# EAGLE design D32 Pro Benchtop Test Board (EAGLE 9.6.2)
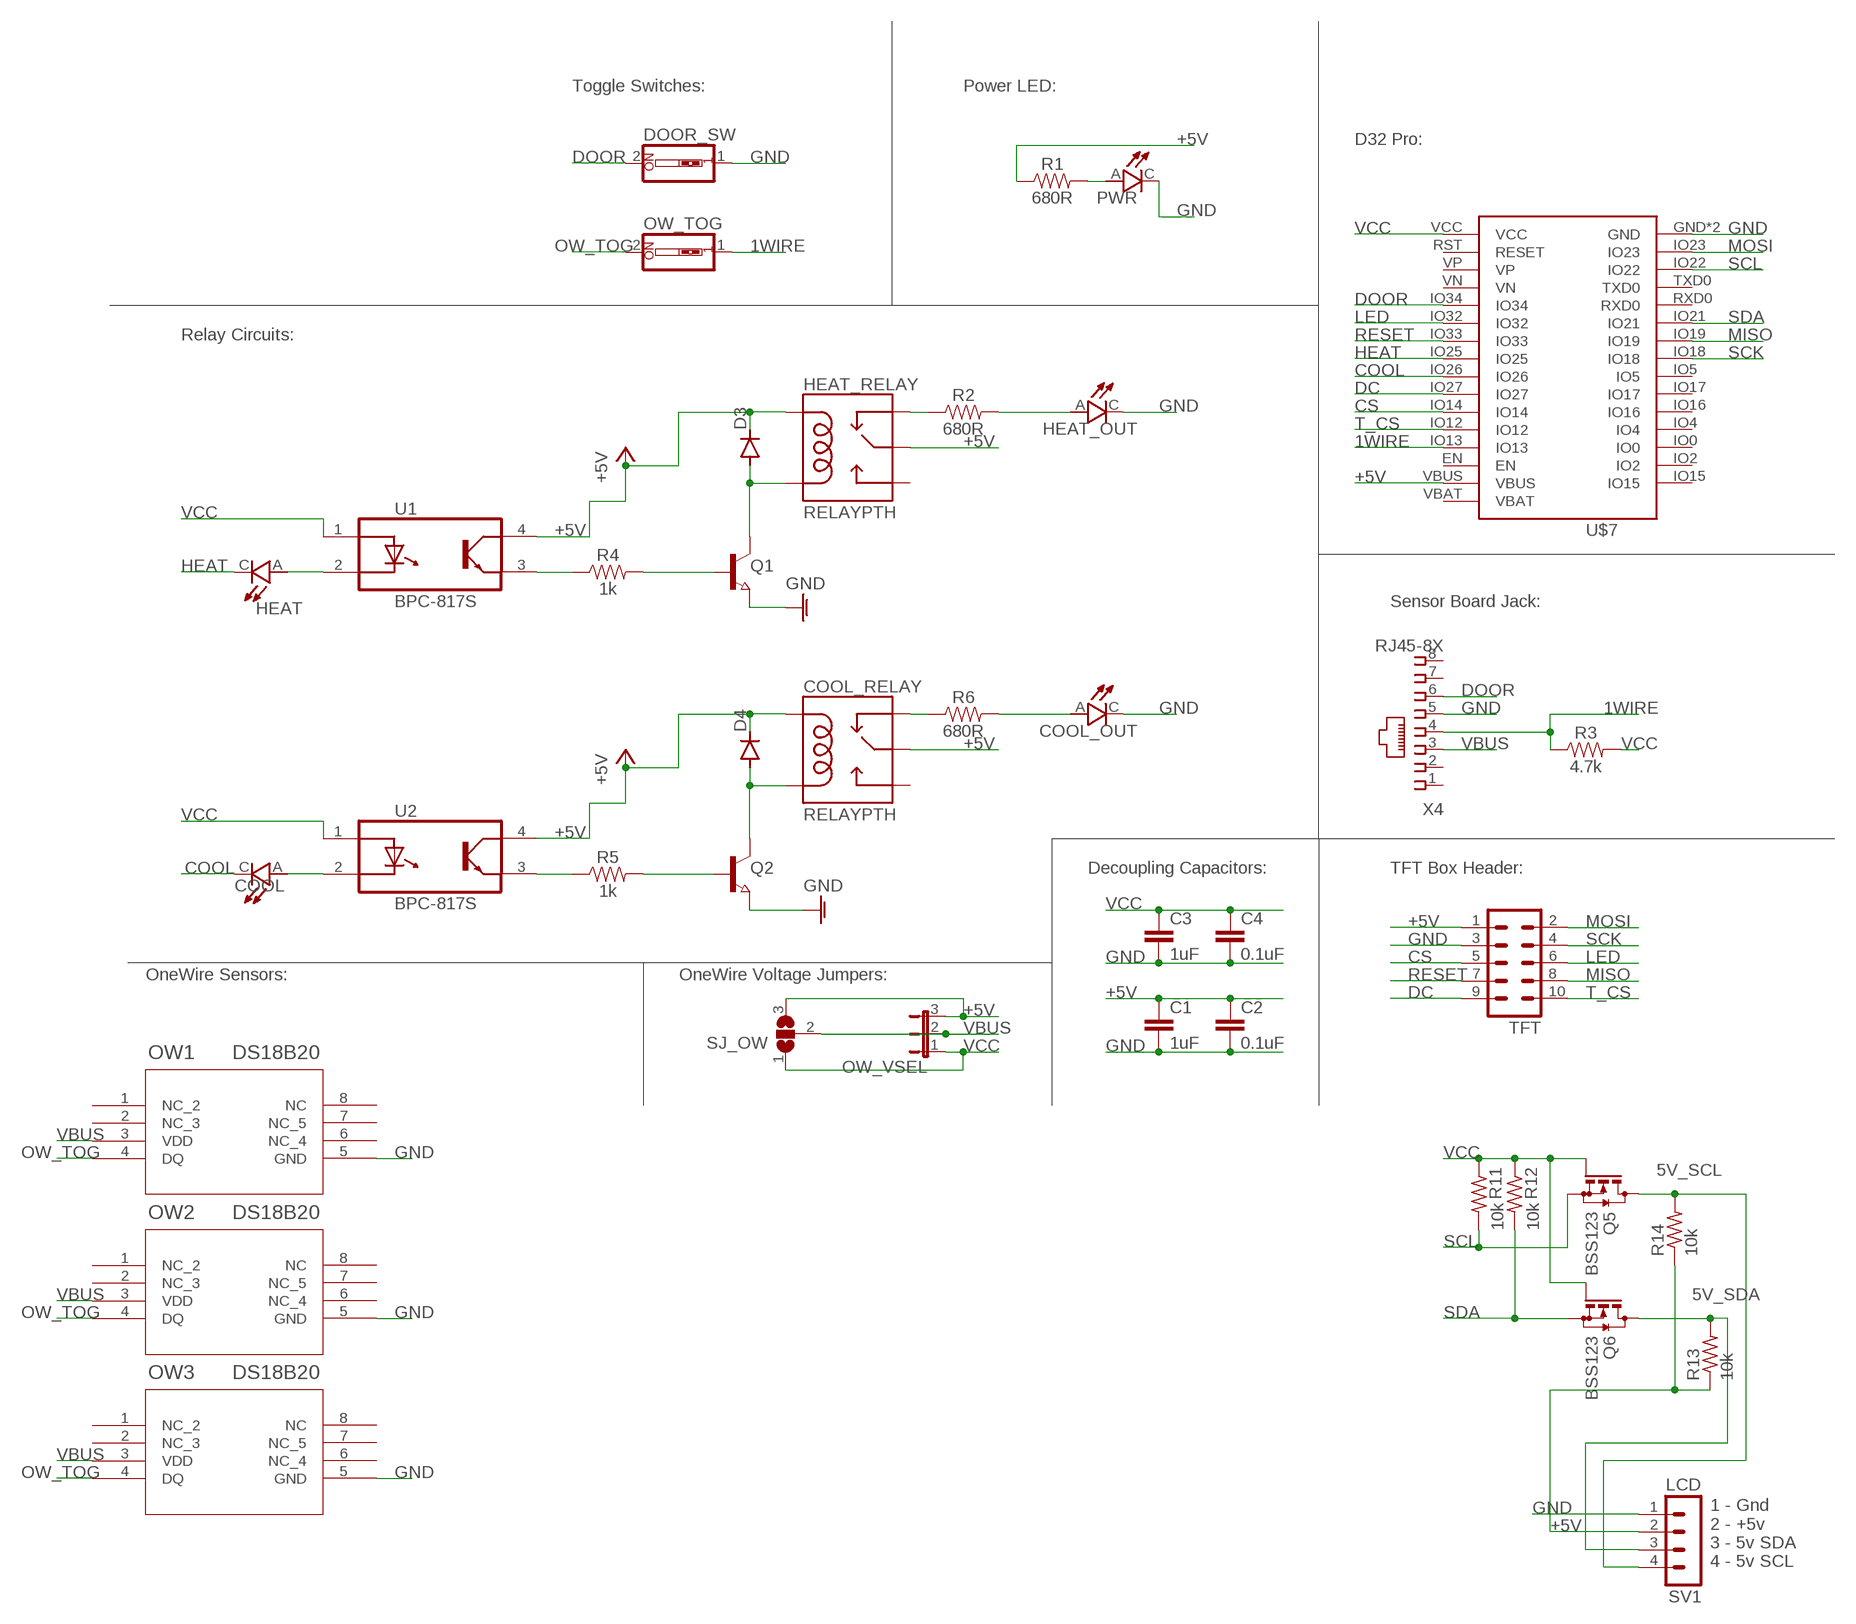
[diagram p0: schematic, sheet 1]

## Parts
C1  1uF  CAP_SMD0805  [SMD-0805]
C2  0.1uF  CAP_SMD0805  [SMD-0805]
C3  1uF  CAP_SMD0805  [SMD-0805]
C4  0.1uF  CAP_SMD0805  [SMD-0805]
COOL  LED_0603LED_SMD_0603  [LED_SMD_0603]
COOL_OUT  LED_0603LED_SMD_0603  [LED_SMD_0603]
COOL_RELAY  RELAYPTH  [SRD-05VDC-SL-C]
D3  DIODE-DO214AC  [DO214AC]
D4  DIODE-DO214AC  [DO214AC]
DOOR_SW  SW_DIP-1  [EDG-01]
HEAT  LED_0603LED_SMD_0603  [LED_SMD_0603]
HEAT_OUT  LED_0603LED_SMD_0603  [LED_SMD_0603]
HEAT_RELAY  RELAYPTH  [SRD-05VDC-SL-C]
OW1  DS18B20  DS18B20Z+T&R  [21-0041B_8_MXM]
OW2  DS18B20  DS18B20Z+T&R  [21-0041B_8_MXM]
OW3  DS18B20  DS18B20Z+T&R  [21-0041B_8_MXM]
OW_TOG  SW_DIP-1  [EDG-01]
OW_VSEL  JP2ENOLABEL  [JP2-NOLABEL]
PWR  LED_0603LED_SMD_0603  [LED_SMD_0603]
Q1  NPN-TRANSISTOR_SOT23  [SOT23]
Q2  NPN-TRANSISTOR_SOT23  [SOT23]
Q5  BSS123  [SOT23]
Q6  BSS123  [SOT23]
R1  680R  RES_SMD0805  [SMD-0805]
R2  680R  RES_SMD0805  [SMD-0805]
R3  4.7k  RES_SMD0805  [SMD-0805]
R4  1k  RES_SMD0805  [SMD-0805]
R5  1k  RES_SMD0805  [SMD-0805]
R6  680R  RES_SMD0805  [SMD-0805]
R11  10k  R-US_R0805  [R0805]
R12  10k  R-US_R0805  [R0805]
R13  10k  R-US_R0805  [R0805]
R14  10k  R-US_R0805  [R0805]
SJ_OW  SJ2W  [SJ_2]
SV1  LCD  HDR-4  [HDR-4_VERT]
TFT  MA05-2  [MA05-2]
U1  BPC-817S  [SOIC127P700X210-4N]
U2  BPC-817S  [SOIC127P700X210-4N]
U$7  WEMOS-D32D32_PRO_NO-KEEPOUT  [D32_PRO_NO-KEEPOUT]
X4  RJ45-8X  [RJ45-NO-SHIELD]

## Nets
1WIRE: OW_TOG.1 R3.1 U$7.IO13 X4.4
5V_SCL: Q5.3(D) R14.2 SV1.4
5V_SDA: Q6.3(D) R13.2 SV1.3
+5V: C1.1 C2.1 COOL_RELAY.COIL1 COOL_RELAY.SWCOMMON D3.C D4.C HEAT_RELAY.COIL1 HEAT_RELAY.SWCOMMON OW_VSEL.3 R1.1 R13.1 R14.1 SJ_OW.3 SV1.2 TFT.1 U1.4(CO) U2.4(CO) U$7.VBUS
COOL: COOL.C U$7.IO26
CS: TFT.5 U$7.IO14
DC: TFT.9 U$7.IO27
DOOR: DOOR_SW.2 U$7.IO34 X4.6
GND: C1.2 C2.2 C3.2 C4.2 COOL_OUT.C DOOR_SW.1 HEAT_OUT.C OW1.5(GND) OW2.5(GND) OW3.5(GND) PWR.C Q1.2(E) Q2.2(E) SV1.1 TFT.3 U$7.GND U$7.GND2(GND) X4.5 ; supply symbol labelled GNDA
HEAT: HEAT.C U$7.IO25
LED: TFT.6 U$7.IO32
MISO: TFT.8 U$7.IO19
MOSI: TFT.2 U$7.IO23
N$1: Q1.1(B) R4.2
N$3: PWR.A R1.2
N$4: R4.1 U1.3(E)
N$5: COOL_RELAY.COIL0 D4.A Q2.3(C)
N$6: R5.1 U2.3(E)
N$7: Q2.1(B) R5.2
N$8: COOL_RELAY.SWCLOSED(SWCLOSE) R6.1
N$9: COOL_OUT.A R6.2
N$10: HEAT_OUT.A R2.2
N$11: HEAT_RELAY.SWCLOSED(SWCLOSE) R2.1
N$12: HEAT.A U1.2(C)
N$14: D3.A HEAT_RELAY.COIL0 Q1.3(C)
N$16: COOL.A U2.2(C)
OW_TOG: OW1.4(DQ) OW2.4(DQ) OW3.4(DQ) OW_TOG.2
RESET: TFT.7 U$7.IO33
SCK: TFT.4 U$7.IO18
SCL: Q5.2(S) R11.2 U$7.IO22
SDA: Q6.2(S) R12.2 U$7.IO21
T_CS: TFT.10 U$7.IO12
VBUS: OW1.3(VDD) OW2.3(VDD) OW3.3(VDD) OW_VSEL.2 SJ_OW.2 X4.3
VCC: C3.1 C4.1 OW_VSEL.1 Q5.1(G) Q6.1(G) R3.2 R11.1 R12.1 SJ_OW.1 U1.1(A) U2.1(A) U$7.VCC
Unconnected: COOL_RELAY.SWOPEN HEAT_RELAY.SWOPEN OW1.1(NC_2) OW1.2(NC_3) OW1.6(NC_4) OW1.7(NC_5) OW1.8(NC) OW2.1(NC_2) OW2.2(NC_3) OW2.6(NC_4) OW2.7(NC_5) OW2.8(NC) OW3.1(NC_2) OW3.2(NC_3) OW3.6(NC_4) OW3.7(NC_5) OW3.8(NC) U$7.EN U$7.IO0 U$7.IO2 U$7.IO4 U$7.IO5 U$7.IO15 U$7.IO16 U$7.IO17 U$7.RST(RESET) U$7.RXD0 U$7.TXD0 U$7.VBAT U$7.VN U$7.VP X4.1 X4.2 X4.7 X4.8

## Notes on the sheet
- Toggle Switches: | Power LED:
- D32 Pro:
- Relay Circuits:
- Sensor Board Jack:
- Decoupling Capacitors: | TFT Box Header:
- OneWire Sensors: | OneWire Voltage Jumpers:
- 1 - Gnd
  2 - +5v
  3 - 5v SDA
  4 - 5v SCL

## Library data of the parts
C1 C3 = Donnie:CAP_SMD; LCSC_PART: C28323
C2 C4 = Donnie:CAP_SMD; LCSC_PART: C49678
COOL COOL_OUT HEAT HEAT_OUT PWR = Donnie:LED_0603: RED CHIP LED MINI-MOLD Check availability <https://pricing.snapeda.com/parts/SML-D12U1WT86/Rohm/view-part?ref=eda>; DESCRIPTION: Red 620nm LED Indication - Discrete 2.2V 0603 (1608 Metric); LCSC_PART: C2286; PACKAGE: 0603 Rohm
COOL_RELAY HEAT_RELAY = SRD-05VDC-SL-C:RELAY: SPDT relay (COM-00101); JLC_X: -0.3; JLC_Y: -0.2; LCSC_PART: C35449
D3 D4 = diode:DIODE-: DIODE; LCSC_PART: C95872
DOOR_SW OW_TOG = special:SW_DIP-1: DIP SWITCH; LCSC_PART: C126888
OW1-OW3 = Donnie:DS18B20Z+T&R; COPYRIGHT: Copyright (C) 2024 Ultra Librarian. All rights reserved.; JLC_R: -90; LCSC_PART: C695837; MANUFACTURER_PART_NUMBER: DS18B20Z+T&R; MFR_NAME: Analog Devices / Maxim Integrated
OW_VSEL = Donnie:JP2E: JUMPER; LCSC_PART: C2937625
Q1 Q2 = semicon-smd-ipc:NPN-TRANSISTOR_: NPN TRANSISTOR; JLC_R: -90; LCSC_PART: C20526
Q5 Q6 = transistor-small-signal:BSS123: N-CHANNEL MOS FET; JLC_R: -90; LCSC_PART: C79015
R1 R2 R6 = Donnie:RES_SMD; LCSC_PART: C17798
R3 = Donnie:RES_SMD; LCSC_PART: C17673
R4 R5 = Donnie:RES_SMD; LCSC_PART: C17513
R11-R14 = rcl:R-US_: RESISTOR, American symbol; LCSC_PART: C17902
SJ_OW = jumper:SJ2W: SMD solder JUMPER
SV1 = Donnie:HDR-4: PIN HEADER; JLC_X: 3.8; LCSC_PART: C2691448
TFT = Box Header:MA05-2: PIN HEADER; OC_FARNELL: unknown; OC_NEWARK: unknown
U1 U2 = Donnie:BPC-817S: Check availability <https://pricing.snapeda.com/parts/VOS618A-7X001T/Vishay/view-part?ref=eda>; LCSC_PART: C106900
U$7 = Donnie:WEMOS-D32: D32_REVERSE is a Reverse silkscreen for placing the Wemos D32 on the underside of the board D32_NO-KEEPOUT removes the keepout area beneath the antenna on the D32 and provides a note to avoid components and traces.; JLC_R: 90; JLC_X: 1.3; JLC_Y: -11.4; LCSC_PART: C18078137
X4 = Box Header:RJ45: CORCOM Modular RJ Jacks No Shield Source: www.tycoelectronics.com .. ENG_DS_1654001_1099_RJ_L_0507.pdf; JLC_Y: 7.55; LCSC_PART: C3000197; MPN: RJ45-8X; OC_FARNELL: unknown; OC_NEWARK: 16R6101

## Net classes
0 default: width 1.016 mm, clearance 0.254 mm
1 AC: width 2.54 mm, clearance 1.2 mm
3 Gnd: width 0.406 mm, clearance 0.406 mm

## Board
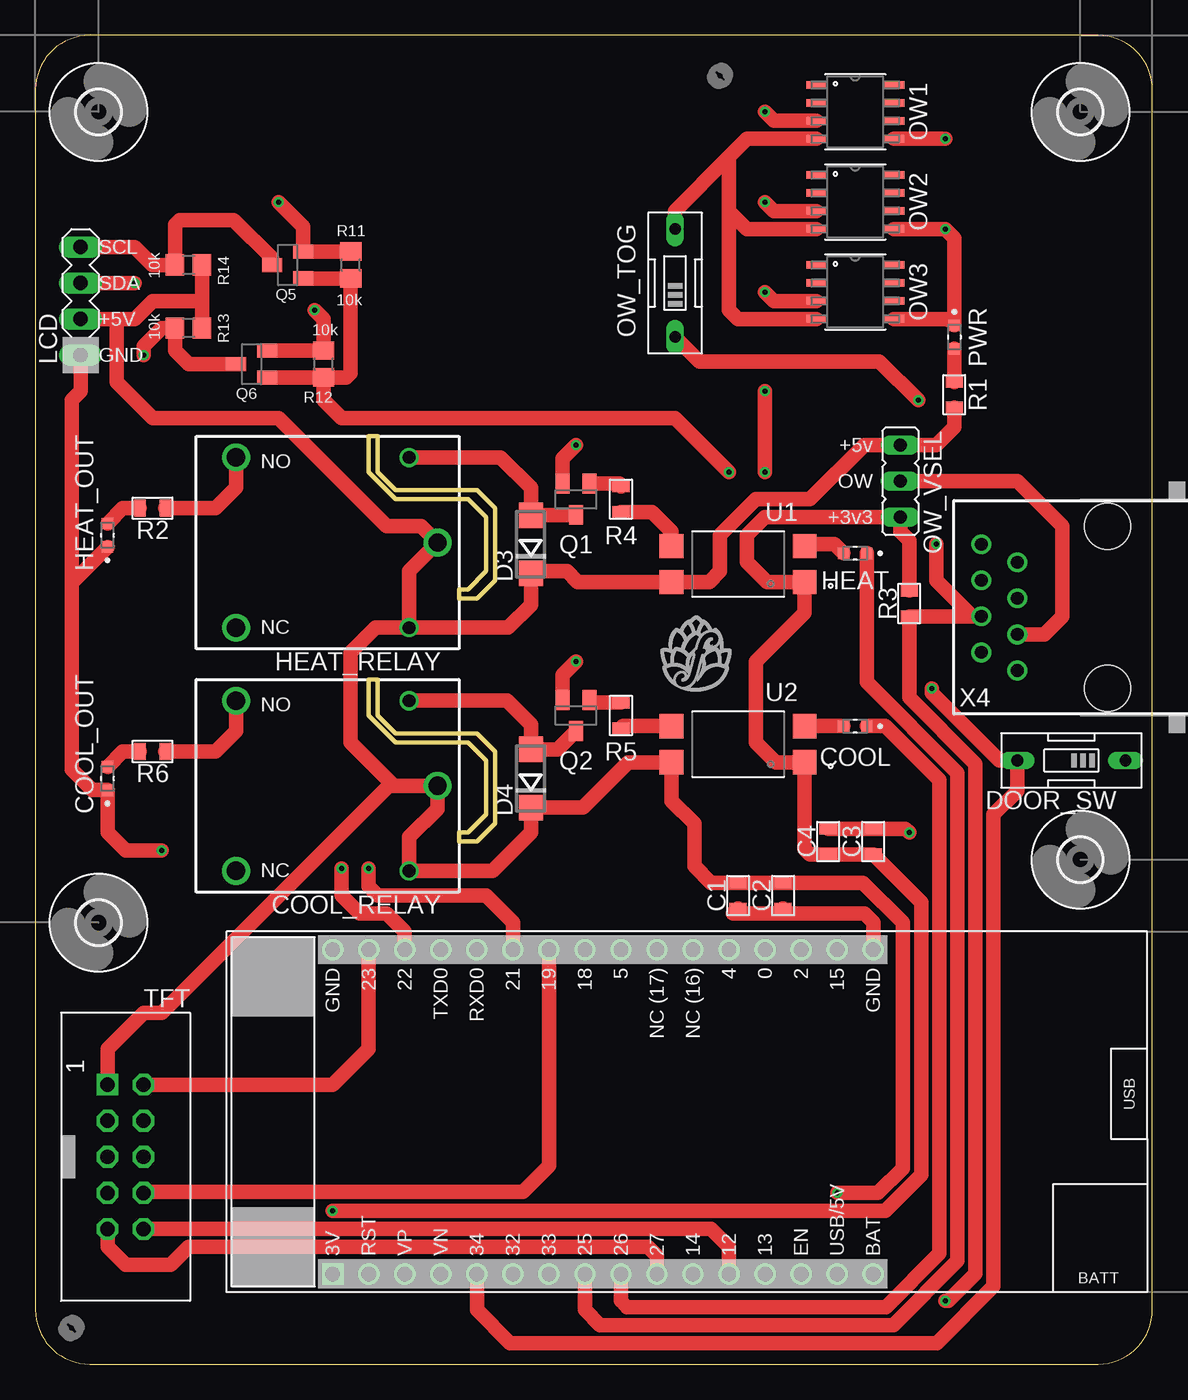
[diagram p1: board, top side]
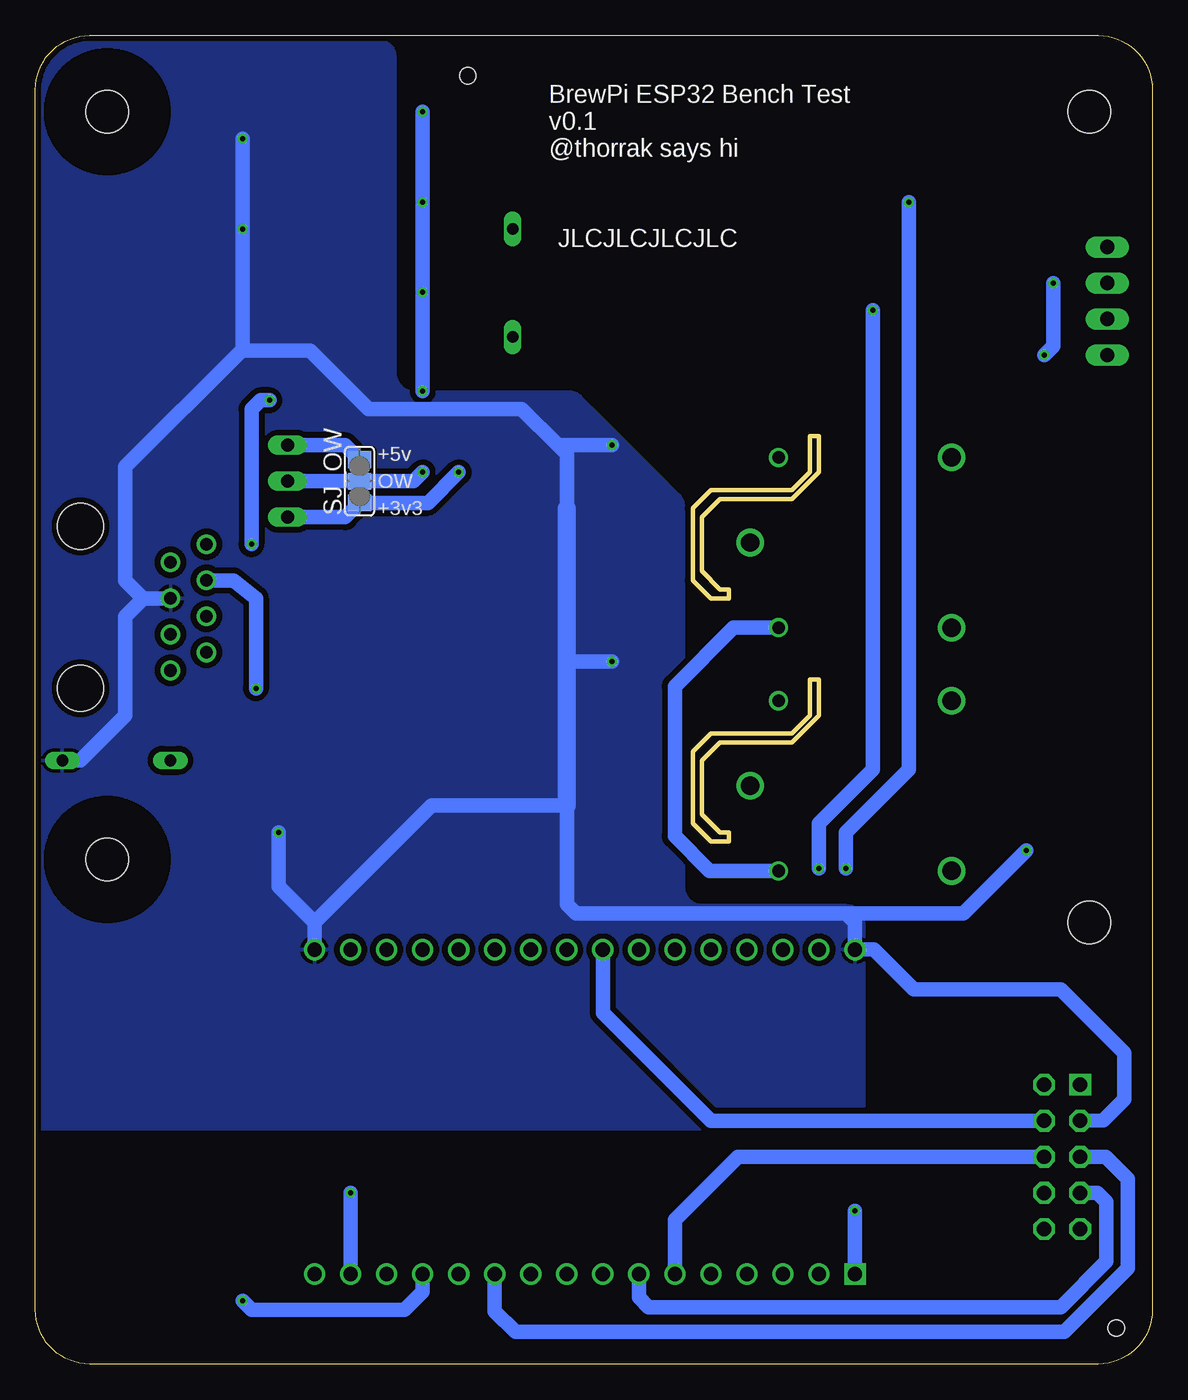
[diagram p2: board, bottom side, seen from below]

Size 78.73 x 93.65 mm. Coordinates in mm from the lower left corner, seen from the top.
Outline: 0,89.84 0,3.81 arc90 3.81,0 74.92,0 arc90 78.73,3.81 78.73,89.84 arc90 74.92,93.65 3.81,93.65 arc90 0,89.84
Outline: 24.13,65.41 24.13,62.87 25.4,61.59 31.11,61.59 32.38,60.32 32.38,55.24 31.11,53.98 29.84,53.98 29.84,54.61 30.48,54.61 31.75,55.88 31.75,59.69 30.48,60.96 25.4,60.96 23.5,62.87 23.5,65.41 24.13,65.41
Outline: 23.5,48.26 24.13,48.26 24.13,45.72 25.4,44.45 31.11,44.45 32.38,43.18 32.38,38.1 31.11,36.83 29.84,36.83 29.84,37.46 30.48,37.46 31.75,38.73 31.75,42.55 30.48,43.81 25.4,43.81 23.5,45.72 23.5,48.26
Copper layers (1*16): Top 0.0356mm / dielectric 1.5011mm / Bottom 0.0356mm
Design rules "PCBs_io": minimum track width 6mil, minimum drill 13mil, track to track 6mil, track to pad 6mil, pad to pad 6mil, via to via 6mil, smd to smd 6mil, copper to edge 15mil, drill to drill 6mil, minimum pad ring 7mil, minimum via ring 7mil, stop-mask expansion 3mil, vias tented up to drill 0mil, thermal gap 10mil

### Footprints (pad centres in the part's own frame; a part is rotated, then mirrored left to right if it is on the bottom)
SMD-0805 = smd 0.8 x 1.2: 1 -0.9,0; 2 0.9,0
LED_SMD_0603 = smd 0.8 x 0.8: A 0.825,0; C -0.825,0
SRD-05VDC-SL-C = drill 0.9: COIL0 -5.39,-6.12; COIL1 -5.39,5.88 | drill 1.3: SWCLOSED 6.81,-6.12; SWCOMMON -7.39,-0.12; SWOPEN 6.81,5.88
DO214AC = smd 1.8 x 1.7: A 2.05,0; C -2.05,0
EDG-01 = drill 0.813 long: 1 0,-3.81; 2 0,3.81
21-0041B_8_MXM = smd 1.46 x 0.533: 1 -2.724,1.905; 2 -2.724,0.635; 3 -2.724,-0.635; 4 -2.724,-1.905; 5 2.724,-1.905; 6 2.724,-0.635; 7 2.724,0.635; 8 2.724,1.905
JP2-NOLABEL = drill 0.914 long: 1 -2.54,0; 2 0,0; 3 2.54,0
SOT23 = smd 1 x 1.4: 1 -0.95,-1.1; 2 0.95,-1.1; 3 0,1.1
R0805 = smd 1.3 x 1.5: 1 -0.95,0; 2 0.95,0
SJ_2 = smd 1.168 x 1.6: 1 -1.524,0; 2 0,0; 3 1.524,0
HDR-4_VERT = drill 1.016 long: 1 0,0; 2 2.54,0; 3 5.08,0; 4 7.62,0
MA05-2 = drill 1.016 square: 1 -5.08,-1.27 | drill 1.016 octagon: 2 -5.08,1.27; 3 -2.54,-1.27; 4 -2.54,1.27; 5 0,-1.27; 6 0,1.27; 7 2.54,-1.27; 8 2.54,1.27; 9 5.08,-1.27; 10 5.08,1.27
SOIC127P700X210-4N = smd 1.68 x 1.71: 1 -4.692,1.27; 2 -4.692,-1.27; 3 4.692,-1.27; 4 4.692,1.27
3,0 = hole 3: 0,0
1.152 = hole 1.152: 0,0
D32_PRO_NO-KEEPOUT = drill 1: EN -11.43,-12.7; GND 11.43,20.32; GND2 11.43,-17.78; IO0 11.43,-10.16; IO2 11.43,-12.7; IO4 11.43,-7.62; IO5 11.43,0; IO12 -11.43,-7.62; IO13 -11.43,-10.16; IO14 -11.43,-5.08; IO15 11.43,-15.24; IO16 11.43,-5.08; IO17 11.43,-2.54; IO18 11.43,2.54; IO19 11.43,5.08; IO21 11.43,7.62; IO22 11.43,15.24; IO23 11.43,17.78; IO25 -11.43,2.54; IO26 -11.43,0; IO27 -11.43,-2.54; IO32 -11.43,7.62; IO33 -11.43,5.08; IO34 -11.43,10.16; RST -11.43,17.78; RXD0 11.43,10.16; TXD0 11.43,12.7; VBAT -11.43,-17.78; VBUS -11.43,-15.24; VN -11.43,12.7; VP -11.43,15.24 | drill 1 square: VCC -11.43,20.32
RJ45-NO-SHIELD = drill 0.9 pad 1.4: 1 -4.445,6.35; 2 -3.175,8.89; 3 -1.905,6.35; 4 -0.635,8.89; 5 0.635,6.35; 6 1.905,8.89; 7 3.175,6.35; 8 4.445,8.89 | hole 3.251: -5.715,0; 5.715,0

### Placement (x,y rotation side)
C1  49.53,33.02 270 top
C2  52.7,33.02 270 top
C3  59.05,36.83 90 top
C4  55.88,36.83 90 top
COOL  57.78,44.96 180 top
COOL_OUT  5.08,41.27 90 top
COOL_RELAY  20.96,40.64 180 top
D3  34.92,57.79 90 top
D4  34.92,41.27 90 top
DOOR_SW  73.03,42.55 90 top
HEAT  57.78,57.15 180 top
HEAT_OUT  5.08,58.42 90 top
HEAT_RELAY  20.96,57.79 180 top
OW1  57.78,88.27 0 top
OW2  57.78,81.92 0 top
OW3  57.78,75.57 0 top
OW_TOG  45.08,76.2 0 top
OW_VSEL  60.96,62.23 90 top
PWR  64.77,72.39 270 top
Q1  38.1,60.96 180 top
Q2  38.1,45.72 180 top
Q5  17.78,77.47 90 top
Q6  15.24,70.48 90 top
R1  64.77,68.33 90 top
R2  8.26,60.32 180 top
R3  61.59,53.61 90 top
R4  41.27,60.96 90 top
R5  41.27,45.72 90 top
R6  8.26,43.18 180 top
R11  22.23,77.47 90 top
R12  20.32,70.48 90 top
R13  10.79,73.03 180 top
R14  10.79,77.47 180 top
SJ_OW  55.88,62.23 90 bottom
SV1  3.18,71.12 90 top
TFT  6.35,14.6 270 top
U1  49.53,56.39 180 top
U2  49.53,43.69 180 top
U$1  [3,0]  4.45,88.27 0 top
U$2  [3,0]  4.45,31.12 0 top
U$3  [3,0]  73.66,35.56 0 top
U$4  [3,0]  73.66,88.27 0 top
U$5  [1.152]  2.54,2.54 0 top
U$6  [1.152]  48.26,90.81 0 top
U$7  41.27,17.78 90 top
X4  75.56,53.34 90 top

### Tracks (layer width: path | path; a pad name or v marks a point on that pad's centre or on a via)
1WIRE  (via drill 0.35)
  Top 1.016: v64.14,4.45 64.37,4.45 66.27,6.35 66.27,42.31 61.59,46.99 R3.1 66.04,52.71 | 66.04,52.71 X4.4 | v62.23,67.95 59.51,70.67 46.81,70.67 OW_TOG.1 | v63.5,57.79 63.5,55.24 66.04,52.71
  Bottom 1.016: v64.14,4.45 63.5,3.81 52.7,3.81 51.43,5.08 U$7.IO13 | v62.23,67.95 62.87,67.95 63.5,67.31 v63.5,57.79
5V_SCL
  Top 1.016: SV1.4 6.99,78.74 8.26,77.47 R14.2 9.85,80.33 10.16,80.65 13.97,80.65 16.68,77.94 Q5.3
5V_SDA  (via drill 0.35)
  Top 1.016: Q6.3 10.79,70.48 9.85,71.44 R13.2 8.89,73.03 7.62,71.76 v7.62,71.12 | SV1.3 v6.99,76.2
  Bottom 1.016: v6.99,76.2 6.99,71.76 v7.62,71.12
+5V  (via drill 0.35)
  Top 1.016: HEAT_RELAY.COIL1 33.33,51.91 34.92,53.5 D3.C 35.07,55.88 37.46,55.88 38.23,55.12 U1.4 47.5,55.12 48.26,55.88 48.26,58.42 50.8,60.96 54.61,60.96 58.42,64.77 OW_VSEL.3 63.5,64.77 64.77,66.04 R1.1 | v56.51,12.06 59.39,12.06 61.13,13.8 61.13,31.12 58.32,33.92 C2.1 C1.1 47.62,33.92 46.45,35.1 46.45,38.1 44.84,39.71 U2.4 41.78,42.42 38.59,39.23 D4.C 34.92,37.46 32.22,34.76 COOL_RELAY.COIL1 26.34,37.14 28.34,39.14 COOL_RELAY.SWCOMMON | TFT.1 5.08,22.23 7.62,24.77 8.89,24.77 24.89,40.76 COOL_RELAY.SWCOMMON | HEAT_RELAY.COIL1 26.34,55.91 HEAT_RELAY.SWCOMMON 27.2,59.05 24.77,59.05 17.14,66.68 8.26,66.68 5.71,69.22 5.71,73.66 SV1.2 6.99,73.66 8.26,74.93 11.75,74.93 | HEAT_RELAY.COIL1 23.96,51.91 22.23,50.16 22.23,43.81 25.28,40.76 COOL_RELAY.SWCOMMON | R13.1 11.75,74.93 | 11.75,74.93 R14.1
  Bottom 1.016: HEAT_RELAY.COIL1 29.52,51.91 33.65,47.77 33.65,37.21 31.2,34.76 COOL_RELAY.COIL1 | U$7.VBUS v56.51,12.06 | SJ_OW.3 56.9,64.77 OW_VSEL.3
COOL
  Top 1.016: U$7.IO26 41.27,4.45 41.7,4.02 59.95,4.02 63.73,7.8 63.73,41.15 59.93,44.96 COOL.C
CS
  Bottom 1.016: TFT.5 3.28,14.6 1.73,13.06 1.73,6.75 6.19,2.29 44.9,2.29 46.35,3.74 U$7.IO14
DC
  Top 1.016: TFT.9 5.08,8.26 6.35,6.99 9.53,6.99 10.79,8.26 43.18,8.26 43.81,7.62 U$7.IO27
DOOR  (via drill 0.35)
  Top 1.016: v63.18,47.62 63.18,47.31 67.54,42.95 67.95,42.55 DOOR_SW.2 69.22,40.41 67.54,38.73 67.54,5.47 63.54,1.48 33.45,1.48 31.11,3.81 U$7.IO34
  Bottom 1.016: X4.6 64.77,55.24 63.18,53.98 v63.18,47.62
GND  (via drill 0.35)
  Top 1.016: 52.7,31.75 49.16,31.75 C1.2 | 52.7,31.75 58.42,31.75 59.05,31.12 U$7.GND2 | C4.2 C3.2 61.33,37.73 v61.59,37.46 | C2.2 52.7,31.75 | Q1.2 37.15,63.82 v38.1,64.77 | Q2.2 37.15,48.58 v38.1,49.53 | HEAT_OUT.C 2.54,55.05 | 2.54,55.05 2.54,41.91 4,40.45 COOL_OUT.C 5.08,37.46 6.35,36.2 v8.89,36.2 | OW1.5 v64.14,86.36 | OW2.5 v64.14,80.01 64.77,79.38 PWR.C 64.33,73.66 OW3.5 | 2.54,55.05 2.54,67.95 3.18,68.58 SV1.1
  Bottom 1.016: 41.27,60.32 41.27,64.14 41.91,64.77 | 71.12,53.98 72.39,55.24 72.39,63.25 64.2,71.43 | TFT.3 3.44,17.17 1.96,18.65 1.96,21.92 6.46,26.42 16.82,26.42 19.62,29.21 U$7.GND 20.96,31.12 21.59,31.75 | 59.05,31.12 50.8,39.37 41.27,39.37 41.27,32.38 40.64,31.75 21.59,31.75 | 59.05,31.12 U$7.GND2 | 41.91,64.77 44.45,67.31 55.24,67.31 59.37,71.43 64.2,71.43 | v61.59,37.46 61.59,33.66 59.05,31.12 | v38.1,64.77 41.91,64.77 | v38.1,49.53 41.27,49.53 | v8.89,36.2 13.34,31.75 21.59,31.75 | v64.14,86.36 v64.14,80.01 64.14,71.5 64.2,71.43 | X4.5 71.12,53.98 | 71.12,53.98 72.39,52.7 72.39,45.72 75.56,42.55 DOOR_SW.1
  Bottom 1.27: 41.27,39.37 41.27,49.53 41.27,60.32
  pour Bottom (isolate 0.406): 78.74,93.34 54.61,93.34 arc90 53.34,92.08 53.34,69.85 arc-90 52.07,68.58 41.17,68.58 arc45 40.27,68.21 33.39,61.33 arc45 33.02,60.43 33.02,33.66 arc-90 31.75,32.38 21.59,32.38 arc90 20.32,31.12 20.32,16.51 78.74,16.51
HEAT
  Top 1.016: U$7.IO25 38.73,3.81 39.8,2.75 60.47,2.75 65,7.27 65,41.68 58.61,48.07 HEAT.C
LED
  Bottom 1.016: U$7.IO32 33.65,10.16 29.21,14.6 TFT.6
MISO
  Top 1.016: TFT.8 7.73,12.15 34.38,12.15 36.2,13.97 36.2,19.69 U$7.IO19
MOSI
  Top 1.016: TFT.2 20.96,19.69 23.5,22.23 U$7.IO23
N$1
  Top 1.016: R4.2 41.18,62.06 Q1.1
N$3
  Top 1.016: R1.2 PWR.A
N$4
  Top 1.016: U1.3 44.84,58.67 43.45,60.06 R4.1
N$5
  Top 1.016: COOL_RELAY.COIL0 33.25,46.76 34.92,45.09 D4.A 36.8,43.32 Q2.3
N$6
  Top 1.016: U2.3 41.41,44.96 R5.1
N$7
  Top 1.016: R5.2 39.25,46.62 Q2.1
N$8
  Top 1.016: R6.1 12.7,43.18 14.14,44.62 COOL_RELAY.SWCLOSED
N$9
  Top 1.016: COOL_OUT.A 6.16,43.18 R6.2
N$10
  Top 1.016: HEAT_OUT.A 6.16,60.32 R2.2
N$11
  Top 1.016: R2.1 12.7,60.32 14.14,61.77 HEAT_RELAY.SWCLOSED
N$12
  Top 1.016: HEAT.A 56.32,57.79 54.35,57.79 U1.2
N$14
  Top 1.016: HEAT_RELAY.COIL0 32.78,63.9 34.92,61.76 D3.A 35.07,59.69 35.24,59.86 Q1.3
N$16
  Top 1.016: COOL.A U2.2
OW_TOG
  Top 1.016: OW3.4 49.53,73.66 48.89,74.3 48.89,81.28 | OW2.4 50.16,80.01 48.89,81.28 | 48.89,81.28 48.89,85.09 | 48.89,85.09 50.16,86.36 OW1.4 | OW_TOG.2 45.08,81.28 48.89,85.09
RESET
  Bottom 1.016: U$7.IO33 36.2,4.71 35.5,4.02 6.46,4.02 3.23,7.25 3.23,11.42 3.87,12.06 TFT.7
SCK
  Bottom 1.016: U$7.IO18 38.73,24.77 31.11,17.15 TFT.4
SCL  (via drill 0.35)
  Top 1.016: U$7.IO22 26.04,30.48 24.77,31.75 22.86,31.75 21.59,33.02 v21.59,34.92 | R11.2 Q5.2 18.88,80.18 v17.14,81.92
  Bottom 1.016: v21.59,34.92 21.59,37.46 17.14,41.91 v17.14,81.92
SDA  (via drill 0.35)
  Top 1.016: U$7.IO21 33.65,31.12 31.75,33.02 24.13,33.02 23.5,33.66 v23.5,34.92 | Q6.2 R12.2 20.32,73.66 v19.68,74.3
  Bottom 1.016: v23.5,34.92 23.5,38.1 19.68,41.91 v19.68,74.3
T_CS
  Top 1.016: U$7.IO12 48.89,8.26 47.62,9.53 TFT.10
VBUS  (via drill 0.35)
  Top 1.016: OW_VSEL.2 69.22,62.23 72.39,59.05 72.39,52.7 71.12,51.43 X4.3 | OW1.3 52.07,87.63 v51.43,88.27 | OW2.3 52.07,81.28 v51.43,81.92 | OW3.3 52.07,74.93 v51.43,75.57 | v51.43,62.87 v51.43,68.58
  Bottom 1.016: OW_VSEL.2 SJ_OW.2 52.07,62.23 v51.43,62.87 | v51.43,88.27 v51.43,81.92 v51.43,75.57 v51.43,68.58
VCC  (via drill 0.35)
  Top 1.016: R3.2 61.59,58.05 60.96,58.68 OW_VSEL.1 51.43,59.69 50.16,58.42 50.16,56.52 51.56,55.12 U1.1 54.22,52.95 50.8,49.53 50.8,43.81 52.2,42.42 U2.1 54.22,36.32 54.61,35.93 C4.1 C3.1 62.46,32.52 62.46,13.33 59.92,10.79 v20.96,10.79 | Q6.1 R12.1 | R12.1 21.91,69.54 22.23,69.85 R11.1 Q5.1 | v48.89,62.87 45.08,66.68 21.59,66.68 20.32,67.95 R12.1
  Bottom 1.016: v20.96,10.79 U$7.VCC | OW_VSEL.1 56.9,59.69 SJ_OW.1 51.05,60.71 v48.89,62.87

### Text on the board
tPlace: SCL | SDA | +5V | GND | NO | NC | NO | NC
tNames: +5v | OW | +3v3
bNames: BrewPi ESP32 Bench Test / v0.1 / @thorrak says hi | JLCJLCJLCJLC | +5v | OW | +3v3